# Altium schematic sheet mainBord_real.SchDoc
size A2
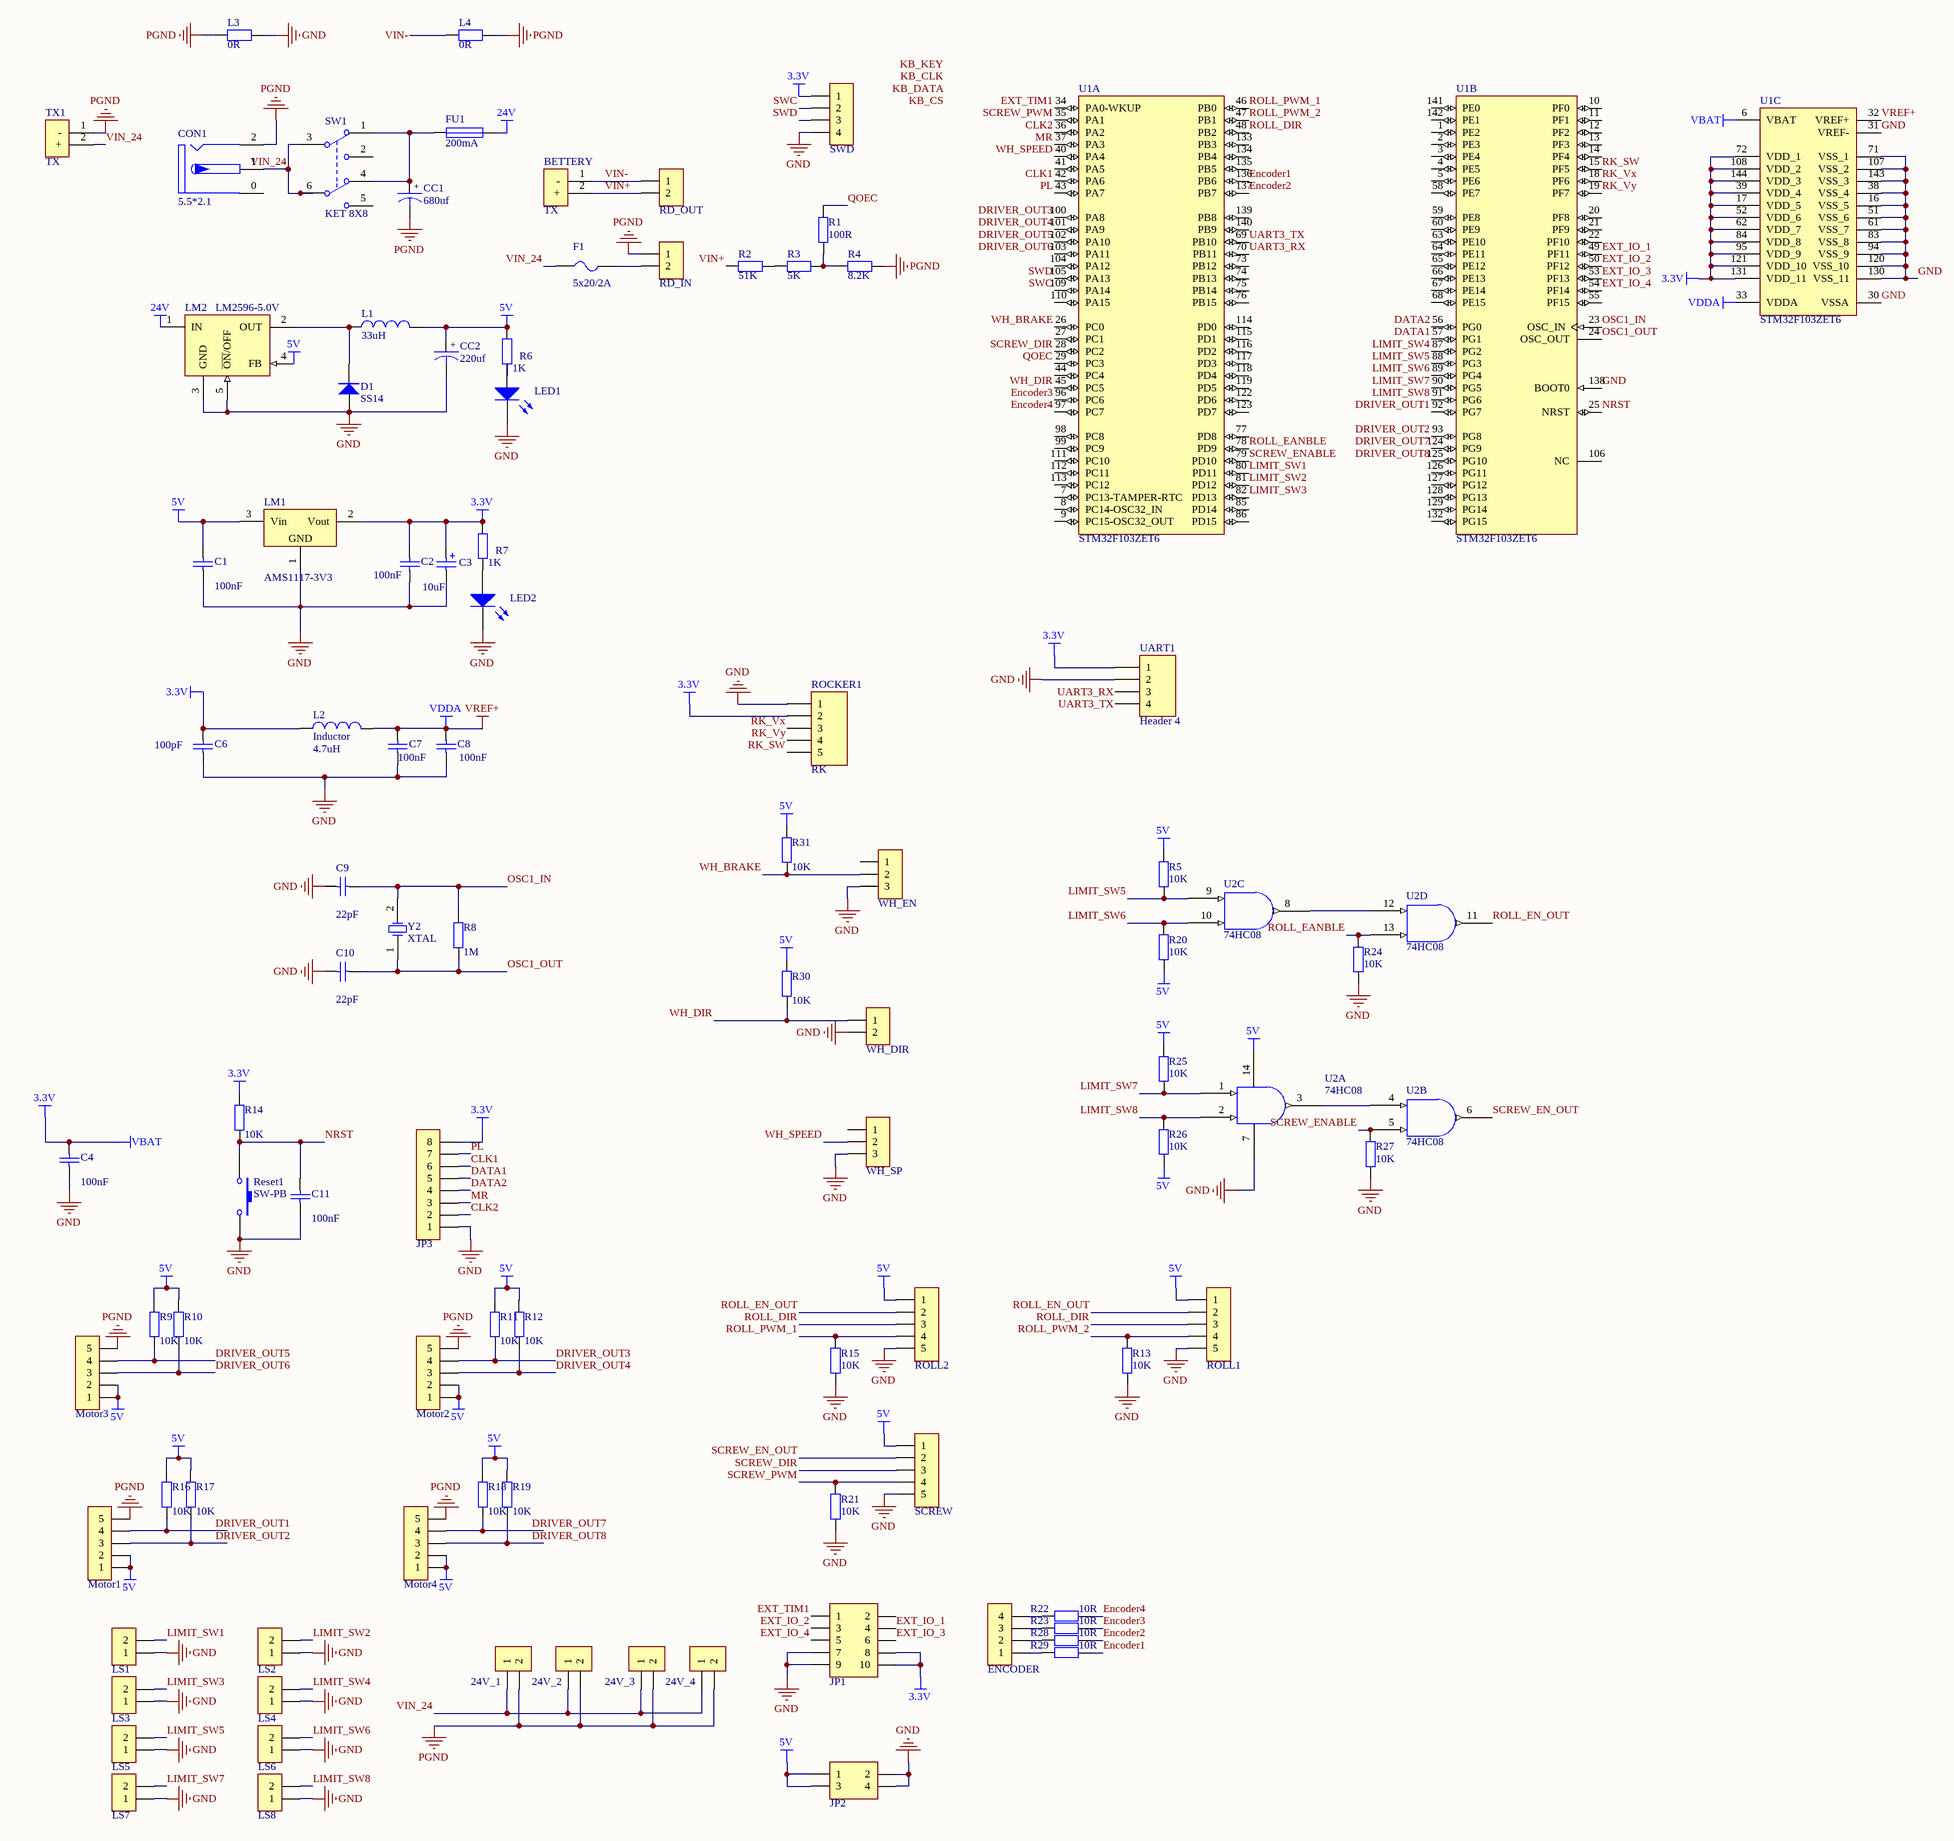
[diagram p0: mainBord_real.SchDoc]

## Parts
24V_1  HDR-1X2  [KF2EDGK5.0-LI-2P]  (value not drawn)
24V_2  HDR-1X2  [KF2EDGK5.0-LI-2P]  (value not drawn)
24V_3  HDR-1X2  [KF2EDGK5.0-LI-2P]  (value not drawn)
24V_4  HDR-1X2  [KF2EDGK5.0-LI-2P]  (value not drawn)
BETTERY  TX  [TX]
C1  100nf  [C 0805_L]
C2  100nf  [C 0805_L]
C3  10uf  [CD A(3216)]
C4  100nf  [C 0805_L]
C6  value 100pF  [C 0805_L]  (hidden comment: 100nf)
C7  100nf  [C 0805_L]
C8  100nf  [C 0805_L]
C9  22pf  [C 0805_L]
C10  22pf  [C 0805_L]
C11  100nf  [C 0805_L]
CC1  680uf  [CM F(10*10.2)]
CC2  220uf  [CM E(8*10.2)]
CON1  5.5*2.1  [DC-005]
D1  SS14  [SMA]
ENCODER  HDR-1X4  [HDR2.54-LI-4P]  (value not drawn)
F1  5x20/2A  [FU 5x20]
FU1  200mA  [R 1206-HP_M]
JP1  Header 5X2  [HDR2.54-LI-2x5P]  (value not drawn)
JP2  Header2X2  [HDR2.54-LI-2x2P]  (value not drawn)
JP3  HDR-1X8  [XH2.54-LI-8P]  (value not drawn)
L1  value 33uH  [CDRH125]  (hidden comment: Inductor)
L2  Inductor  value 4.7uH  [L 0805]
L3  value 0R  [R 0805_L]  (hidden comment: 1K)
L4  value 0R  [R 0805_L]  (hidden comment: 1K)
LED1  LED2  [LED 0805B]  (value not drawn)
LED2  LED2  [LED 0805B]  (value not drawn)
LM1  AMS1117-3V3  [SOT223_L]
LM2  LM2596-5.0V  [TO263-5A]
LS1  HDR-1X2  [XH2.54-LI-2P]  (value not drawn)
LS2  HDR-1X2  [XH2.54-LI-2P]  (value not drawn)
LS3  HDR-1X2  [XH2.54-LI-2P]  (value not drawn)
LS4  HDR-1X2  [XH2.54-LI-2P]  (value not drawn)
LS5  HDR-1X2  [XH2.54-LI-2P]  (value not drawn)
LS6  HDR-1X2  [XH2.54-LI-2P]  (value not drawn)
LS7  HDR-1X2  [XH2.54-LI-2P]  (value not drawn)
LS8  HDR-1X2  [XH2.54-LI-2P]  (value not drawn)
Motor1  HDR-1X5  [KF128-3.81-5P]  (value not drawn)
Motor2  HDR-1X5  [KF128-3.81-5P]  (value not drawn)
Motor3  HDR-1X5  [KF128-3.81-5P]  (value not drawn)
Motor4  HDR-1X5  [KF128-3.81-5P]  (value not drawn)
R1  value 100R  [R 0805_L]  (hidden comment: 1K)
R2  value 51K  [R 0805_L]  (hidden comment: 1K)
R3  value 5K  [R 0805_L]  (hidden comment: 1K)
R4  value 8.2K  [R 0805_L]  (hidden comment: 1K)
R5  value 10K  [R 0805_L]  (hidden comment: 5K)
R6  1K  [R 0805_L]
R7  1K  [R 0805_L]
R8  1M  [R 0805_L]
R9  value 10K  [R 0805_L]  (hidden comment: 1K)
R10  value 10K  [R 0805_L]  (hidden comment: 1K)
R11  value 10K  [R 0805_L]  (hidden comment: 1K)
R12  value 10K  [R 0805_L]  (hidden comment: 1K)
R13  value 10K  [R 0805_L]  (hidden comment: 1K)
R14  value 10K  [R 0805_L]  (hidden comment: 1K)
R15  value 10K  [R 0805_L]  (hidden comment: 1K)
R16  value 10K  [R 0805_L]  (hidden comment: 1K)
R17  value 10K  [R 0805_L]  (hidden comment: 1K)
R18  value 10K  [R 0805_L]  (hidden comment: 1K)
R19  value 10K  [R 0805_L]  (hidden comment: 1K)
R20  value 10K  [R 0805_L]  (hidden comment: 5K)
R21  value 10K  [R 0805_L]  (hidden comment: 1K)
R22  value 10R  [R 0805_L]  (hidden comment: 1K)
R23  value 10R  [R 0805_L]  (hidden comment: 1K)
R24  value 10K  [R 0805_L]  (hidden comment: 1K)
R25  value 10K  [R 0805_L]  (hidden comment: 5K)
R26  value 10K  [R 0805_L]  (hidden comment: 5K)
R27  value 10K  [R 0805_L]  (hidden comment: 1K)
R28  value 10R  [R 0805_L]  (hidden comment: 1K)
R29  value 10R  [R 0805_L]  (hidden comment: 1K)
R30  value 10K  [R 0805_L]  (hidden comment: 1K)
R31  value 10K  [R 0805_L]  (hidden comment: 1K)
RD_IN  HDR-1X2  [KF2EDGK5.0-WI-2P]  (value not drawn)
RD_OUT  HDR-1X2  [KF2EDGK5.0-WI-2P]  (value not drawn)
Reset1  SW-PB  [switch_1]
ROCKER1  RK  [HDR2.54-M-LI-5P]
ROLL1  HDR-1X5  [XH2.54-LI-5P]  (value not drawn)
ROLL2  HDR-1X5  [XH2.54-LI-5P]  (value not drawn)
SCREW  HDR-1X5  [XH2.54-LI-5P]  (value not drawn)
SW1  KET 8X8  [KFT DIP-8X8]
SWD  HDR-1X4  [HDR2.54-LI-4P]  (value not drawn)
TX1  TX  [TX]
U1  STM32F103ZET6  [STM-LQFP144_N]  (parts A,B,C of 3)
U2  74HC08  [SOP14_N]  (parts A,B,C,D of 4)
UART1  Header 4  [HDR2.54-LI-4P]
WH_DIR  HDR-1X2  [XH2.54-LI-2P]  (value not drawn)
WH_EN  HDR-1X3  [XH2.54-LI-3P]  (value not drawn)
WH_SP  HDR-1X3  [XH2.54-LI-3P]  (value not drawn)
Y2  XTAL  [OSC HC-49S]

## Nets
3.3V: C2.2 C3.1 C4.1 C6.2 JP1.8 JP1.10 JP3.8 L2.1 LM1.2(Vout) R7.2 R14.2 ROCKER1.2 SWD.1 U1.6(VBAT) U1.17(VDD_5) U1.39(VDD_4) U1.52(VDD_6) U1.62(VDD_7) U1.72(VDD_1) U1.84(VDD_8) U1.95(VDD_9) U1.108(VDD_2) U1.121(VDD_10) U1.131(VDD_11) U1.144(VDD_3) UART1.1  [also labelled VBAT]
5V: C1.2 CC2.1 JP2.1 JP2.3 L1.2 LM1.3(Vin) LM2.4(FB) Motor1.1 Motor1.2 Motor2.1 Motor2.2 Motor3.1 Motor3.2 Motor4.1 Motor4.2 R5.2 R6.2 R9.2 R10.2 R11.2 R12.2 R16.2 R17.2 R18.2 R19.2 R20.1 R25.2 R26.1 R30.2 R31.2 ROLL1.1 ROLL2.1 SCREW.1 U2.14(VCC)
24V: FU1.2 LM2.1(IN)
GND: C1.1 C2.1 C3.2 C4.2 C6.1 C7.1 C8.1 C9.2 C10.2 C11.2 CC2.2 D1.1(A) JP1.7 JP1.9 JP2.2 JP2.4 JP3.1 L3.1 LED1.2(K) LED2.2(K) LM1.1(GND) LM2.3(GND) LM2.5(~{ON}/OFF) LS1.1 LS2.1 LS3.1 LS4.1 LS5.1 LS6.1 LS7.1 LS8.1 R13.2 R15.2 R21.2 R24.1 R27.1 Reset1.2 ROCKER1.1 ROLL1.5 ROLL2.5 SCREW.5 SWD.4 U1.16(VSS_5) U1.30(VSSA) U1.31(VREF-) U1.38(VSS_4) U1.51(VSS_6) U1.61(VSS_7) U1.71(VSS_1) U1.83(VSS_8) U1.94(VSS_9) U1.107(VSS_2) U1.120(VSS_10) U1.130(VSS_11) U1.138(BOOT0) U1.143(VSS_3) U2.7(GND) UART1.2 WH_DIR.2 WH_EN.3 WH_SP.3
PGND: 24V_1.2 24V_2.2 24V_3.2 24V_4.2 CC1.2 CON1.2 L3.2 L4.1 Motor1.5 Motor2.5 Motor3.5 Motor4.5 R4.1 RD_IN.1 TX1.1(-)
VREF+: C7.2 C8.2 L2.2 U1.32(VREF+) U1.33(VDDA)  [also labelled VDDA]
CLK1: JP3.6 U1.42(PA6)
CLK2: JP3.2 U1.36(PA2)
DATA1: JP3.5 U1.57(PG1)
DATA2: JP3.4 U1.56(PG0)
DRIVER_OUT1: Motor1.4 R16.1 U1.92(PG7)
DRIVER_OUT2: Motor1.3 R17.1 U1.93(PG8)
DRIVER_OUT3: Motor2.4 R11.1 U1.100(PA8)
DRIVER_OUT4: Motor2.3 R12.1 U1.101(PA9)
DRIVER_OUT5: Motor3.4 R9.1 U1.102(PA10)
DRIVER_OUT6: Motor3.3 R10.1 U1.103(PA11)
DRIVER_OUT7: Motor4.4 R18.1 U1.124(PG9)
DRIVER_OUT8: Motor4.3 R19.1 U1.125(PG10)
Encoder1: R29.2 U1.136(PB6)
Encoder2: R28.2 U1.137(PB7)
Encoder3: R23.2 U1.96(PC6)
Encoder4: R22.2 U1.97(PC7)
EXT_IO_1: JP1.4 U1.49(PF11)
EXT_IO_2: JP1.3 U1.50(PF12)
EXT_IO_3: JP1.6 U1.53(PF13)
EXT_IO_4: JP1.5 U1.54(PF14)
EXT_TIM1: JP1.1 U1.34(PA0-WKUP)
LIMIT_SW1: LS1.2 U1.80(PD11)
LIMIT_SW2: LS2.2 U1.81(PD12)
LIMIT_SW3: LS3.2 U1.82(PD13)
LIMIT_SW4: LS4.2 U1.87(PG2)
LIMIT_SW5: LS5.2 R5.1 U1.88(PG3) U2.9
LIMIT_SW6: LS6.2 R20.2 U1.89(PG4) U2.10
LIMIT_SW7: LS7.2 R25.1 U1.90(PG5) U2.1
LIMIT_SW8: LS8.2 R26.2 U1.91(PG6) U2.2
MR: JP3.3 U1.37(PA3)
NRST: C11.1 R14.1 Reset1.1 U1.25(NRST)
OSC1_IN: C9.1 R8.2 U1.23(OSC_IN) Y2.2(OSC2)
OSC1_OUT: C10.1 R8.1 U1.24(OSC_OUT) Y2.1(OSC1)
PL: JP3.7 U1.43(PA7)
QOEC: R1.1 U1.29(PC3)
RK_SW: ROCKER1.5 U1.15(PF5)
RK_Vx: ROCKER1.3 U1.18(PF6)
RK_Vy: ROCKER1.4 U1.19(PF7)
ROLL_DIR: ROLL1.3 ROLL2.3 U1.48(PB2)
ROLL_EANBLE: R24.2 U1.78(PD9) U2.13
ROLL_EN_OUT: ROLL1.2 ROLL2.2 U2.11
ROLL_PWM_1: R15.1 ROLL2.4 U1.46(PB0)
ROLL_PWM_2: R13.1 ROLL1.4 U1.47(PB1)
SCREW_DIR: SCREW.3 U1.28(PC2)
SCREW_EN_OUT: SCREW.2 U2.6
SCREW_ENABLE: R27.2 U1.79(PD10) U2.5
SCREW_PWM: R21.1 SCREW.4 U1.35(PA1)
SWC: SWD.2 U1.109(PA14)
SWD: SWD.3 U1.105(PA13)
UART3_RX: U1.70(PB11) UART1.3
UART3_TX: U1.69(PB10) UART1.4
VIN+: BETTERY.2(+) R2.2 RD_OUT.2
VIN-: BETTERY.1(-) L4.2 RD_OUT.1
VIN_24: 24V_1.1 24V_2.1 24V_3.1 24V_4.1 CON1.1 F1.2 SW1.3(NO1) SW1.6(NC2) TX1.2(+)
WH_BRAKE: R31.1 U1.26(PC0) WH_EN.2
WH_DIR: R30.1 U1.45(PC5) WH_DIR.1
WH_SPEED: U1.40(PA4) WH_SP.2
NetCC1_1: CC1.1 FU1.1 SW1.1(NC1) SW1.4(NO2)
NetD1_2: D1.2(K) L1.1 LM2.2(OUT)
NetENCODER_1: ENCODER.1 R29.1
NetENCODER_2: ENCODER.2 R28.1
NetENCODER_3: ENCODER.3 R23.1
NetENCODER_4: ENCODER.4 R22.1
NetF1_1: F1.1 RD_IN.2
NetLED1_1: LED1.1(A) R6.1
NetLED2_1: LED2.1(A) R7.1
NetR1_2: R1.2 R3.1 R4.2
NetR2_1: R2.1 R3.2
NetU2_3: U2.3 U2.4
NetU2_8: U2.8 U2.12

Not connected (* = marked no-connect by the designer): CON1 0; JP1 2; SW1 2(COM2) 5(COM2); U1 1(PE2) 2(PE3) 3(PE4) 4(PE5) 5(PE6) 7(PC13-TAMPER-RTC) 8(PC14-OSC32_IN) 9(PC15-OSC32_OUT) 10(PF0) 11(PF1) 12(PF2) 13(PF3) 14(PF4) 20(PF8) 21(PF9) 22(PF10) 27(PC1) 41(PA5) 44(PC4) 55(PF15) 58(PE7) 59(PE8) 60(PE9) 63(PE10) 64(PE11) 65(PE12) 66(PE13) 67(PE14) 68(PE15) 73(PB12) 74(PB13) 75(PB14) 76(PB15) 77(PD8) 85(PD14) 86(PD15) 98(PC8) 99(PC9) 104(PA12) 106(NC) 110(PA15) 111(PC10) 112(PC11) 113(PC12) 114(PD0) 115(PD1) 116(PD2) 117(PD3) 118(PD4) 119(PD5) 122(PD6) 123(PD7) 126(PG11) 127(PG12) 128(PG13) 129(PG14) 132(PG15) 133(PB3) 134(PB4) 135(PB5) 139(PB8) 140(PB9) 141(PE0) 142(PE1); WH_EN 1; WH_SP 1

## Notes on the sheet
- Labels drawn without touching a wire or pin: KB_CLK, KB_CS, KB_DATA, KB_KEY
- Title
- Size:
- Date:
- File:
- A2
- Number:
- Time:
- Revision:
- Sheet
- of
- (in symbol CAP-T) +

## Library data of the parts
24V_1-24V_4 LS1-LS8 RD_IN RD_OUT WH_DIR = Header 2: 2P接插件; 版权归属: 源创客; BOM名称: 2P接插件; 学习资源: www.ooocke.com
BETTERY TX1 = T型插头
C1 C2 C4 C6-C11 = Cap: Capacitor; pin to pad: 1>2 2>1; Published: 8-Jun-2000; LatestRevisionDate: 17-Jul-2002; LatestRevisionNote: Re-released for DXP Platform.; PackageReference: RAD-0.3; Publisher: Altium Limited; PackageDescription: Radial Cap, Thru-Hole; 2 Leads; 0.3 in Pin Spacing
  C1 C2 C4 C7 C8 C11: Value: 100nF
  C9 C10: Value: 22pF
C3 = Cap Pol2: Polarized Capacitor (Axial); Published: 8-Jun-2000; LatestRevisionDate: 17-Jul-2002; LatestRevisionNote: Re-released for DXP Platform.; PackageReference: POLAR0.8; Publisher: Altium Limited; PackageDescription: Polarized Capacitor; 2 Leads; Value: 10uF
CC1 CC2 = CAP-T: 贴片铝解电容
CON1 = DC-005P: 带屏蔽DC电源接口; 版权归属: 源创客; BOM名称: 带屏蔽DC电源接口; 学习资源: www.ooocke.com
D1 = SS14: 肖特基二极管; 版权归属: 源创客; 属性: 40V/1A; BOM名称: 肖特基二极管; 学习资源: www.ooocke.com
ENCODER SWD = Header 4: 4P接插件; 版权归属: 源创客; BOM名称: 4P接插件; 学习资源: www.ooocke.com
F1 = FU DIP: 直插保险丝; 版权归属: 源创客; BOM名称: 直插保险丝; 学习资源: www.ooocke.com
FU1 = FUSE
JP1 = Header 5X2: 5*2P接插件; 版权归属: 源创客; BOM名称: 5*2P接插件; 学习资源: www.ooocke.com
JP2 = Header 2X2: 2*2P接插件; 版权归属: 源创客; BOM名称: 2*2P接插件; 学习资源: www.ooocke.com
JP3 = Header 8: 8P接插件; 版权归属: 源创客; BOM名称: 8P接插件; 学习资源: www.ooocke.com
L1 = Inductor: Manufacturer: Generic Components; Class: Passive; Published: 08/06/2000; Publisher: Altium Hobart Technology Centre; SubClass: Inductor
L2 = Inductor: Code_IEC: 1005; Published: 8-Jun-2000; LatestRevisionDate: 29-May-2009; LatestRevisionNote: IPC-7351 Footprint Added.; PackageReference: 0402-A; Publisher: Altium Limited; PackageDescription: Chip Inductor; Code_JEITA: 0402
L3 L4 R1-R31 = Res2: Resistor; Published: 8-Jun-2000; LatestRevisionDate: 17-Jul-2002; LatestRevisionNote: Re-released for DXP Platform.; PackageReference: AXIAL-0.4; Publisher: Altium Limited; PackageDescription: Axial Device, Thru-Hole; 2 Leads; 0.4 in Pin Spacing
  R6 R7: Value: 1K
  R8: Value: 1M
LED1 LED2 = LED2: Typical RED, GREEN, YELLOW, AMBER GaAs LED; Published: 8-Jun-2000; LatestRevisionDate: 17-Jul-2002; LatestRevisionNote: Re-released for DXP Platform.; PackageVersion: Feb-2002; PackageReference: 3.2X1.6X1.1; Publisher: Altium Limited; PackageDescription: SM LED; 2 Flat Leads
LM1 = AMS1117: 三端稳压芯片; BOM名称: 稳压芯片; 版权归属: 源创客; 学习资源: www.ooocke.com
LM2 = LM2596-5.0: DC降压芯片; BOM名称: DC稳压芯片; 版权归属: 源创客; 学习资源: www.ooocke.com
Motor1-Motor4 ROLL1 ROLL2 SCREW = Header 5: 5P接插件; 版权归属: 源创客; BOM名称: 5P接插件; 学习资源: www.ooocke.com
Reset1 = SW-PB: Switch; Published: 24-Mar-1999; LatestRevisionDate: 17-Jul-2002; LatestRevisionNote: Re-released for DXP Platform.; PackageReference: SPST-2; Publisher: Altium Limited; PackageDescription: Switch; 2 Leads
ROCKER1 = MHDR1X5: Header, 5-Pin; LatestRevisionDate: 17-Jul-2002; LatestRevisionNote: Re-released for DXP Platform.; Publisher: Altium Limited
SW1 = KET 8X8: 8*8自锁开关; 版权归属: 源创客; BOM名称: 8*8自锁开关; 学习资源: www.ooocke.com
U1 = STM32F103ZET6: ARM Cortex-M3 32-bit MCU, 512 KB Flash, 64 KB Internal RAM, 112 I/Os, 144-pin LQFP, -40 to 85 degC, Tray; A/D Converter: 3x12-bit (21 Channel); D/A Converter: 2x12-bit (2 Channel); FLASH Size (Prog) (kB): 512; I/Os (High Current): 112; Internal RAM Size (kB): 64; Operating Frequency(F) (Processor speed) (MHz): 72; Supply Voltage(Vcc) min (V): 2; DatasheetVersion: Rev. 8; PackageVersion: Rev. 4, 06/2013; PackageReference: LQFP144; PackageDescription: 144-Pin Low Profile Quad Flat Package, 20 x 20 mm Body, 0.5 mm Pitch; Supplier 1: Digi-Key; Supplier Part Number 1: 497-6442-ND; Supplier 2: Farnell; Supplier Part Number 2: 1624145; Supplier 3: Newark; Supplier Part Number 3: 57P1270; Supplier 4: Mouser; Supplier Part Number 4: 511-STM32F103ZET6; Core: ARM Cortex-M3; Packing: Tray; Mounting Technology: Surface Mount; PartNumber: STM32F103ZET6; ComponentLink1Description: Manufacturer URL; ComponentLink1URL: http://www.st.com/web/en/home.html; ComponentLink2Description: Datasheet; ComponentLink2URL: http://www.st.com/st-web-ui/static/active/en/resource/technical/document/datasheet/CD00191185.pdf; ComponentLink3Description: Package Specification; ComponentLink3URL: http://www.st.com/st-web-ui/static/active/en/resource/technical/document/datasheet/DM00037051.pdf
UART1 = Header 4: Header, 4-Pin; LatestRevisionDate: 17-Jul-2002; LatestRevisionNote: Re-released for DXP Platform.; Publisher: Altium Limited
WH_EN WH_SP = Header 3: 3P接插件; 版权归属: 源创客; BOM名称: 3P接插件; 学习资源: www.ooocke.com
Y2 = XTAL: Crystal Oscillator; Published: 8-Jun-2000; LatestRevisionDate: 17-Jul-2002; LatestRevisionNote: Re-released for DXP Platform.; PackageReference: R38; Publisher: Altium Limited; PackageDescription: Crystal, Thru-Hole; 2 Leads; Body 3.1 x 8.2 mm (Dia.xH)